# Altium project POWER.PrjPcb
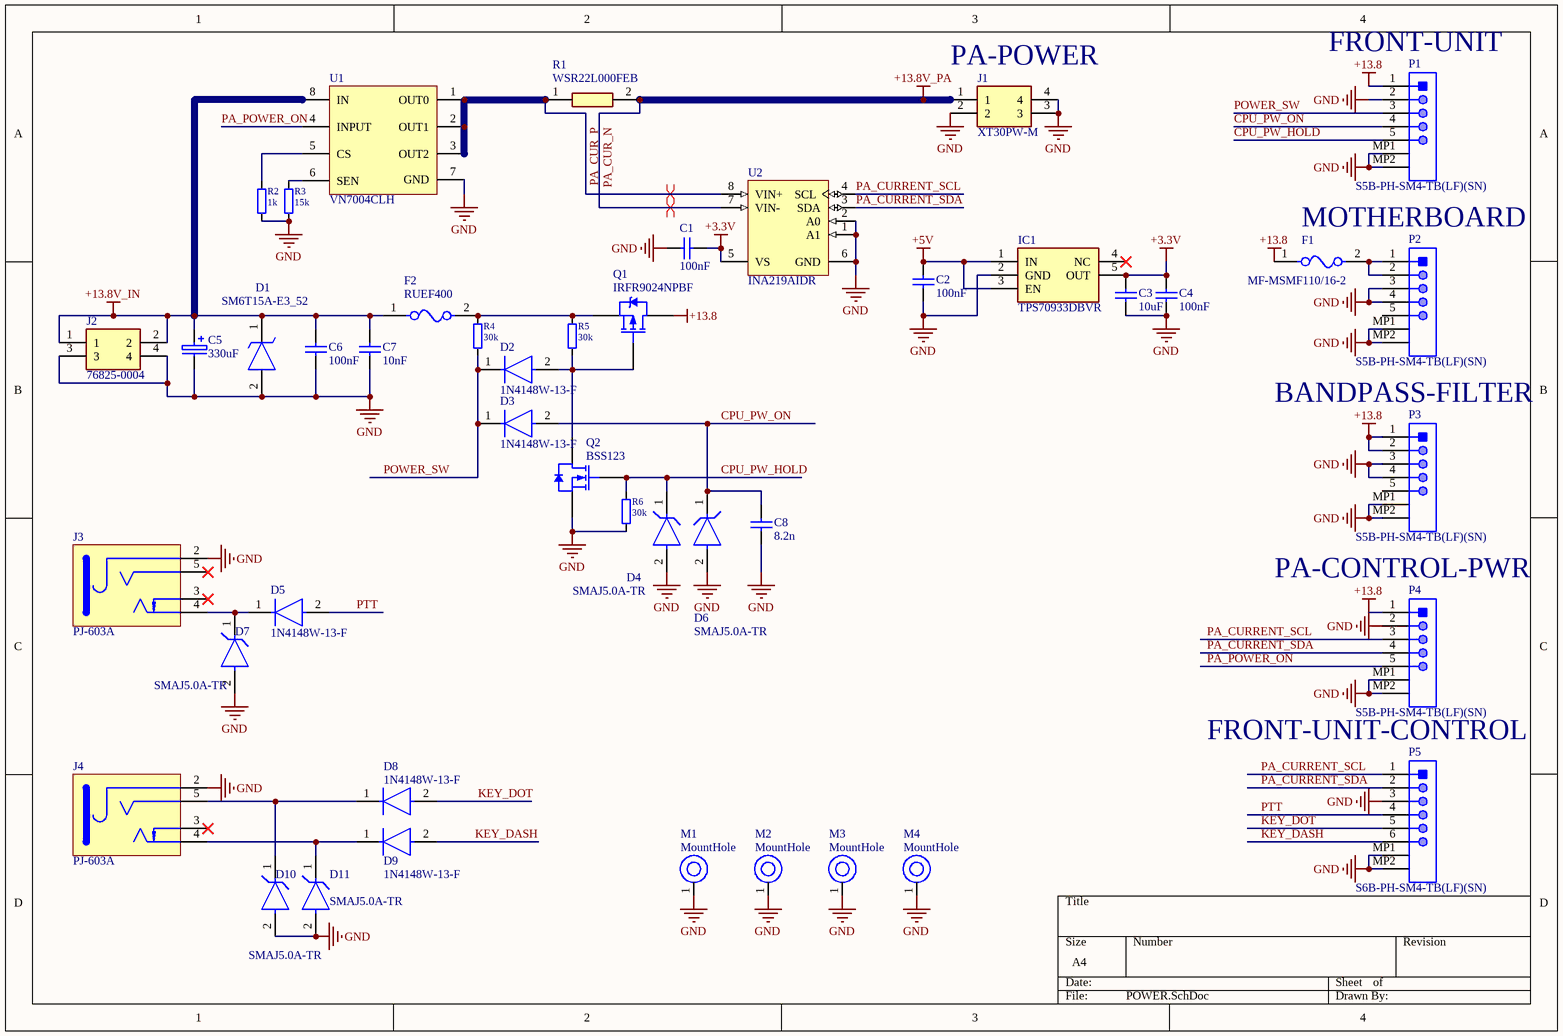
[diagram p0: POWER.SchDoc]
Revision: 4.0
2 sheets, 93 parts. Net scope: global (net labels, ports and power ports of the same name join across sheets).
Board files: POWER.PcbDoc, POWER_2layer.PcbDoc
Sheets:
  POWER.SchDoc
  USB.SchDoc

## Sheet POWER.SchDoc
size A4; SheetNumber: 1; SheetTotal: 2

### Parts
C1  100nF  [C-0805]
C2  100nF  [C-0805]
C3  10uF  [C-0805]
C4  100nF  [C-0805]
C5  330uF  [CE 5.0-10x12.5]
C6  100nF  [C-0805]
C7  10nF  [C-0805]
C8  8.2n  [C-0805]
D1  SM6T15A-E3_52  [DIOM5436X244N]
D2  1N4148W-13-F  [FP-SOD123-MFG]
D3  1N4148W-13-F  [FP-SOD123-MFG]
D4  SMAJ5.0A-TR  [FP-SMA-MFG]
D5  1N4148W-13-F  [FP-SOD123-MFG]
D6  SMAJ5.0A-TR  [FP-SMA-MFG]
D7  SMAJ5.0A-TR  [FP-SMA-MFG]
D8  1N4148W-13-F  [FP-SOD123-MFG]
D9  1N4148W-13-F  [FP-SOD123-MFG]
D10  SMAJ5.0A-TR  [FP-SMA-MFG]
D11  SMAJ5.0A-TR  [FP-SMA-MFG]
F1  MF-MSMF110/16-2  [FP-MF-MSMF110-16-MFG]
F2  RUEF400  [FP-RUEF400-MFG]
IC1  TPS70933DBVR  [SOT95P280X145-5N]
J1  XT30PW-M  [XT30PWM]
J2  76825-0004  [768250004]
J3  PJ-603A  [PJ-603A]
J4  PJ-603A  [PJ-603A]
M1  MountHole  [MountHole]
M2  MountHole  [MountHole]
M3  MountHole  [MountHole]
M4  MountHole  [MountHole]
P1  S5B-PH-SM4-TB(LF)(SN)  [JST-S5B-PH-SM4-TB_V]
P2  S5B-PH-SM4-TB(LF)(SN)  [JST-S5B-PH-SM4-TB_V]
P3  S5B-PH-SM4-TB(LF)(SN)  [JST-S5B-PH-SM4-TB_V]
P4  S5B-PH-SM4-TB(LF)(SN)  [JST-S5B-PH-SM4-TB_V]
P5  S6B-PH-SM4-TB(LF)(SN)  [JST-S6B-PH-SM4-TB(LF)(SN)_V]
Q1  IRFR9024NPBF  [ONSC-DPAK-3-369C-01_V]
Q2  BSS123  [FAIR-SOT23-3_V]
R1  WSR22L000FEB  [RESM11670X254N]
R2  1k  [R-0805]
R3  15k  [R-0805]
R4  30k  [R-0805]
R5  30k  [R-0805]
R6  30k  [R-0805]
U1  VN7004CLH  [OctaPAK7_6P1X6P5_STM-M]
U2  INA219AIDR  [D0008A_L]

### Nets
+3.3V: C1.1 C3.1 C4.1 IC1.5(OUT) U2.5(VS)
+5V: C2.1 IC1.1(IN) IC1.3(EN)
+13.8: F1.1 P1.1 P3.1 P3.2 P4.1 Q1.4(D)
+13.8V_IN: C5.1 C6.1 C7.1 D1.1(K) F2.1 J2.1 J2.2 U1.8(IN)
GND: C1.2 C2.2 C3.2 C4.2 C5.2 C6.2 C7.2 C8.2 D1.2(A) D4.2(A) D6.2(A) D7.2(A) D10.2(A) D11.2(A) IC1.2(GND) J1.2 J1.3 J1.4 J2.3 J2.4 J3.2 J4.2 M1.1 M2.1 M3.1 M4.1 P1.2 P1.MP1 P1.MP2 P2.3 P2.4 P2.MP1 P2.MP2 P3.3 P3.4 P3.MP1 P3.MP2 P4.2 P4.MP1 P4.MP2 P5.3 P5.MP1 P5.MP2 Q2.2(S) R2.1 R3.1 R6.1 U1.7(GND) U2.1(A1) U2.2(A0) U2.6(GND)
PA_CUR_N: J1.1 R1.2 U2.7(VIN-)  [also labelled +13.8V_PA]
CPU_PW_HOLD: D4.1(K) P1.5 Q2.1(G) R6.2
CPU_PW_ON: C8.1 D3.2(A) D6.1(K) P1.4
KEY_DASH: D9.2(A) P5.6
KEY_DOT: D8.2(A) P5.5
PA_CUR_P: R1.1 U1.1(OUT0) U1.2(OUT1) U1.3(OUT2) U2.8(VIN+)
PA_CURRENT_SCL: P4.3 P5.1 U2.4(SCL)
PA_CURRENT_SDA: P4.4 P5.2 U2.3(SDA)
PA_POWER_ON: P4.5 U1.4(INPUT)
POWER_SW: D2.1(C) D3.1(C) P1.3 R4.1
PTT: D5.2(A) P5.4
NetD2_2: D2.2(A) Q1.1(G) Q2.3(D) R5.1
NetD5_1: D5.1(C) D7.1(K) J3.4
NetD8_1: D8.1(C) D10.1(K) J4.5
NetD9_1: D9.1(C) D11.1(K) J4.4
NetF1_2: F1.2 P2.1 P2.2
NetF2_2: F2.2 Q1.3(S) R4.2 R5.2
NetR2_2: R2.2 U1.5(CS)
NetR3_2: R3.2 U1.6(SEN)

Not connected (* = marked no-connect by the designer): IC1 4(NC)*; J3 3* 5*; J4 3*; P2 5; P3 5

### Layout directives
differential pair: PA_CUR_N, PA_CUR_P

### Notes on the sheet
- (near J1) PA-POWER
- (near P1) FRONT-UNIT
- MOTHERBOARD
- BANDPASS-FILTER
- PA-CONTROL-PWR
- FRONT-UNIT-CONTROL

### Library data of the parts
C1-C4 C6-C8 = C semi: Ceramic Multilayer Capacitor; Manufacturer: Yageo/Phycomp; Manufacturer P/N: CC0603JRNPO9BN102; numsch: 011; TypeNum: 155; Parameters: 1nF, NP0, 50V, ±5%; Tolerance: ±10%; Voltage: *
C5 = CE: Capacitor Electrolytic; Manufacturer: Yageo/Phycomp; Manufacturer P/N: SK 016 M 470; numsch: 019; TypeNum: 185; Parameters: 470uF, SK, 16V, ±20%; Tolerance: ±20%; Voltage: *; Series: *
D1 = SM6T15A-E3_52: TVS Diode (Uni-directional); Manufacturer_Name: Vishay; Manufacturer_Part_Number: SM6T15A-E3/52; Datasheet Link: https://www.vishay.com/docs/88385/sm6t.pdf; Height: 2.44mm; Mouser Part Number: 625-SM6T15A-E3; Mouser Price/Stock: https://www.mouser.co.uk/ProductDetail/Vishay-General-Semiconductor/SM6T15A-E3-52?qs=nmw3K3MsCZZRtlXmnTWYow%3D%3D; Arrow Part Number: SM6T15A-E3/52; Arrow Price/Stock: https://www.arrow.com/en/products/sm6t15a-e352/vishay?region=nac
D2 D3 D5 D8 D9 = CMP-12791-000005-1: DIODE GEN PURP 100V 150MA SOD123; Manufacturer: Diodes Inc.; Capacitance: 2pF; Forward Current: 300mA; Max Junction Temp: +150°C; Value: 2pF; Standoff Height: 0mm; Peak Reverse Current: 1uA; Max Surge Forward Current: 1A; Category: Diode; Height: 1.45mm; ComponentLink2URL: https://upverter.com/datasheet/628e7d6fee5901eee6eef4567d1c3569f2cd3cde.pdf; Lead Free: Yes; ComponentLink2Description: Datasheet; Octopart: https://octopart.com/1n4148w-13-f-diodes+inc.-2359612; Temperature Range High: +150°C; Device Class L2: Diodes; Digikey Description: DIODE GEN PURP 100V 150MA SOD123; Reverse Voltage: 100V; Temperature Range Low: -65°C; Device Class L1: Discrete Semiconductors; Package: SOD123; RoHS: TRUE; Manufacturer Part Number: 1N4148W-13-F; Footprint Url: https://www.diodes.com/assets/Package-Files/SOD123.pdf; Automotive: No; Max Repetitive Reverse Voltage: 100V; Mouser Description: 1N4148W Series 2 A 100 V 400 mW Surface Mount Fast Switching Diode - SOD-123; Temperature: -65°C to +150°C; Device Class L3: Rectifier Diodes
D4 D6 D7 D10 D11 = CMP-12225-000048-1: TVS DIODE 5V 13.4V SMA; Manufacturer: STMicroelectronics; Standoff Height: 0.05mm; Max Junction Temp: +150°C; Clamping Voltage: 9.2V; Number Of Channels: 1; Peak Pulse Power: 400W; Peak Pulse Current: 43.5A; Breakdown Voltage: 6.4V; Direction: Unidirectional; ComponentLink2Description: Datasheet; Lead Free: Yes; Package: SMA; Height: 2.65mm; Mouser Description: Transient Voltage Suppressor, TVS, Transil SMAJ Series, Unidirectional, 5 V, DO-214AC, 2, 6.4 V; Manufacturer Part Number: SMAJ5.0A-TR; Reverse Standoff Voltage: 5V; Temperature Range Low: -55°C; Device Class L1: Circuit Protection; RoHS: TRUE; Category: Diode; Automotive: No; ComponentLink2URL: https://www.st.com/resource/en/datasheet/smaj.pdf; Device Class L3: unset; Device Class L2: TVS Diodes; Temperature Range High: +150°C; Octopart: https://octopart.com/smaj5.0a-tr-stmicroelectronics-347063; Digikey Description: TVS DIODE 5V 13.4V SMA; Temperature: -55°C to +150°C
F1 = CMP-07400-000018-1: PTC RESET FUSE 16V 1.1A 1812; Manufacturer: Bourns; Automotive Grade: Grade 3; Trip Current: 2.2A; Trip Time: 0.3s; Value: 0.04-0.21Ω; Current Rating: 100A; Category: Fuse; ComponentLink2Description: Datasheet; Temperature: -40°C to +85°C; Octopart: https://octopart.com/mf-msmf110%2F16-2-bourns-40767; Ambient Temperature Range Low: -40°C; Manufacturer Part Number: MF-MSMF110/16-2; Device Class L3: unset; RoHS: TRUE; Device Class L2: PTC Resettable Fuses; Package: MF-MSMF110/16; Digikey Description: PTC RESET FUSE 16V 1.1A 1812; Height: 0.85mm; Mouser Description: Resettable Fuses - PPTC 1.1A 16V 0.04ohm; Lead Free: Yes; Automotive: Yes; Hold Current: 1.1A; Resistance: 0.04-0.21Ω; Temperature Range Low: -40°C; Device Class L1: Circuit Protection; Ambient Temperature Range High: +85°C; Voltage Rating: 16V; ComponentLink2URL: https://upverter.com/datasheet/72639194a1e73201de7e7957ee4193eb5a54a50e.pdf; Temperature Range High: +85°C
F2 = CMP-08606-000051-1: PTC RESET FUSE 30V 4A RADIAL; Manufacturer: Littelfuse; Current Rating: 100A; Resistance: 0.01-0.05Ω; Trip Time: 12.7s; Trip Current: 8A; Value: 0.01-0.05Ω; Hold Current: 4A; Ambient Temperature Range Low: -40°C; Temperature Range Low: -40°C; Temperature Range High: +85°C; Lead Free: Yes; ComponentLink2URL: https://www.littelfuse.com/~/media/electronics/datasheets/resettable_ptcs/littelfuse_ptc_radial_leaded_ruef_datasheet.pdf.pdf; Temperature: -40°C to +85°C; Device Class L1: Circuit Protection; Voltage Rating: 30V; Ambient Temperature Range High: +85°C; Digikey Description: PTC RESET FUSE 30V 4A RADIAL; RoHS: TRUE; Automotive: No; Category: Fuse; Mouser Description: PTC Resettable Fuse 4A(hold) 8A(trip) 30V 100A 2.5W 12.7s 0.01Ohm Radial 14 X 3 X 19.3mm Bag; Device Class L2: PTC Resettable Fuses; Package: RUEF400; Height: 19.3mm; Device Class L3: unset; ComponentLink2Description: Datasheet; Octopart: https://octopart.com/ruef400-littelfuse-74215791; Manufacturer Part Number: RUEF400
IC1 = TPS70933DBVR: Integrated Circuit; Manufacturer_Name: Texas Instruments; Datasheet Link: http://www.ti.com/lit/gpn/tps709; Height: 1.45mm; Manufacturer_Part_Number: TPS70933DBVR; Mouser Part Number: 595-TPS70933DBVR; Mouser Price/Stock: https://www.mouser.co.uk/ProductDetail/Texas-Instruments/TPS70933DBVR?qs=Z9twEOuL%252B%2FJOaGO60BtvLA%3D%3D; Arrow Part Number: TPS70933DBVR; Arrow Price/Stock: https://www.arrow.com/en/products/tps70933dbvr/texas-instruments?region=nac
J1 = XT30PW-M: Connector; Manufacturer_Name: Amass; Datasheet Link: https://www.tme.eu/sl/Document/ce4077e36b79046da520ca73227e15de/XT30PW%20SPEC.pdf; Height: 5mm; Manufacturer_Part_Number: XT30PW-M
J2 = 76825-0004: Connector; Manufacturer_Name: Molex; Datasheet Link: https://componentsearchengine.com//76825-0004.pdf; Height: 16mm; Mouser2 Part Number: 538-76825-0004; Mouser2 Price/Stock: https://www.mouser.com/Search/Refine.aspx?Keyword=538-76825-0004; Manufacturer_Part_Number: 76825-0004
P1-P4 = CMP-2000-07026-1: Male Header, Pitch 2 mm, 1 x 5 Position, Height 5.5 mm, -25 to 85 degC, RoHS, Tape and Reel; Manufacturer: JST; No of Positions: 5; Pitch: 2mm; Style/Orientation: RightAngleHeader/Plug; Manufacturer URL: http://www.jst.com/home2.html; Datasheet URL: http://www.jst-mfg.com/product/pdf/eng/ePH.pdf; Termination: Crimp; Mounting Technology: SurfaceMount; Package Reference: S5B-PH-SM4-TB; Type: WiretoBoard; Datasheet Version: 12/2012; Package Description: Male Header, Pitch 2 mm, 1 x 5 Position, Height 5.5 mm
P5 = CMP-2000-07027-1: Male Header, Pitch 2 mm, 1 x 6 Position, Height 5.5 mm, -25 to 85 degC; Manufacturer: JST; Pitch: 2mm; Style/Orientation: RightAngleHeader/Plug; No of Positions: 6; Package Reference: S6B-PH-SM4-TB(LF)(SN); Type: ShroudedHeader; Package Description: Male Header, Pitch 2 mm, 1 x 6 Position, Height 5.5 mm; Mounting Technology: SurfaceMount; Datasheet Version: 11/2008; Termination: Solder; Datasheet URL: https://datasheet.ciiva.com/11747/0900766b80df0d9d-11747278.pdf; Manufacturer URL: http://www.jst.com/home2.html
Q1 = CMP-1058-00387-1: IRFR9024NPBF, Транзистор, Р-канал 55В 11А; Manufacturer: On Semiconductor; PartNumber: NTD2955G; Ciss Typ (pF): 500; Qrr Typ (nC): 100; VGS Max (V): 20; PD Max (W): 55; Channel Polarity: P Channel; V(BR)DSS Min (V): 60; ID Max (A): 12; Configuration: Single; Crss Typ (pF): 50; Packing: Tape and Reel; VGS(th) Max (V): 4; Coss Typ (pF): 150; RoHS: Pb-Free; ComponentLink1Description: Manufacturer URL; Mounting Technology: Surface Mount; ComponentLink2URL: http://www.onsemi.cn/pub_link/Collateral/NTD2955-D.PDF; PackageDescription: 3-Pin Flange Mount, Body 6.54 x 6.095 mm, Pitch 2.29 mm; ComponentLink3Description: Package Specification; Package Type: DPAK-3, IPAK-4; ComponentLink3URL: http://www.onsemi.cn/pub_link/Collateral/369C.PDF; DatasheetVersion: Rev. 13; ComponentLink2Description: Datasheet; ComponentLink1URL: http://www.onsemi.com/; PackageVersion: Rev. E, 02/2014; PackageReference: DPAK-3-369C-01
Q2 = CMP-2000-04934-1: N-Channel Logic Level Enhancement Mode Field Effect Transistor, 1.7 V, -55 to 150 degC, 3-Pin SOT-23, RoHS, Tape and Reel; Manufacturer: Fairchild; Channel Type: N; Typical Turn-Off Delay Time: 17ns; Maximum Continuous Drain Current: 0.17A; Rad Hard: No; Typical Rise Time: 9ns; Typical Fall Time: 2.4ns; Maximum Gate Source Voltage: ±20V; Maximum Drain Source Voltage: 100V; Typical Turn-On Delay Time: 1.7ns; RDS-on: 6000@10VmOhm; Package Version: Rev. 12, 03/2016; Packaging: Tape&Reel; Package Reference: SOT23-3; Channel Mode: Enhancement; Operating Temperature: -55to150degC; Package Description: 3-Pin Small Outline Transistor, Body 2.92 x 1.325 mm, Pitch 0.95 mm; Category: MOSFET; Datasheet Version: Jun-03; Datasheet URL: https://www.fairchildsemi.com/datasheets/BS/BSS123.pdf; Manufacturer URL: https://www.fairchildsemi.com/; Mounting: SurfaceMount; Package: 3SOT-23; Package URL: http://www.fairchildsemi.com/dwg/MA/MA03D.pdf
R1 = WSR21L000FEA: Resistor; Manufacturer_Name: Vishay; Datasheet Link: https://componentsearchengine.com/Datasheets/1/WSR21L000FEA.pdf; Height: 2.537mm; Manufacturer_Part_Number: WSR21L000FEA; Mouser Part Number: 71-WSR21L000FEA; Mouser Price/Stock: https://www.mouser.com/Search/Refine.aspx?Keyword=71-WSR21L000FEA; Arrow Part Number: WSR21L000FEA; Arrow Price/Stock: https://www.arrow.com/en/products/wsr21l000fea/vishay
R2-R6 = RES semi: Chip Resistor; Manufacturer: Yageo/Phycomp; Manufacturer P/N: RC0603FR-0749R9L; numsch: 021; TypeNum: 212; Parameters: 49.9R, RC, 0.1W, ±1%, TCR ±100ppm; Power: *; TCR: *; Series: *; Tolerance: *
U2 = CMP-0704-00003-2: Zero-Drift, Bi-Directional Current / Power Monitor, 3 to 5.5 V, -40 to 125 degC, 8-pin SOIC (D8), Green (RoHS & no Sb/Br); Manufacturer: Texas Instruments; Common Mode Range(Min)(V): 0; SubFamily: Current Shunt Monitor; Rating: Catalog; Input Offset (+/-)(Max)(uV): 100; Vs(Max)(V): 5.5; Common Mode Range(Max)(V): 26; Quiescent Current (+/-)(Typ)(mA): 0.7; Vs(Min)(V): 3; Gain(V/V): 1, 0.5, 0.25, 0.125; Small-Signal Bandwidth(Typ)(MHz): 0.011; PackageReference: D0008A; ComponentLink1URL: http://www.ti.com/; Eco-Plan: Green (RoHS & no Sb/Br); ComponentLink2URL: http://www.ti.com/general/docs/lit/getliterature.tsp?genericPartNumber=INA219&fileType=pdf; ComponentLink1Description: Manufacturer URL; ComponentLink3Description: Package Specification; Mounting Technology: Surface Mount; PackageDescription: 8-Pin Plastic Small Outline, Body 4.9 x 3.9 mm, Pitch 1.27 mm; ComponentLink3URL: http://www.ti.com/lit/ml/msoi002j/msoi002j.pdf; DatasheetVersion: SBOS448F; PackageVersion: 4040047-3/M, 06/2011; PartNumber: INA219AIDR; Code_JEDEC: MS-012; ComponentLink2Description: Datasheet; CMRR(Min)(dB): 100

## Sheet USB.SchDoc
size A4; SheetNumber: 2; SheetTotal: 2
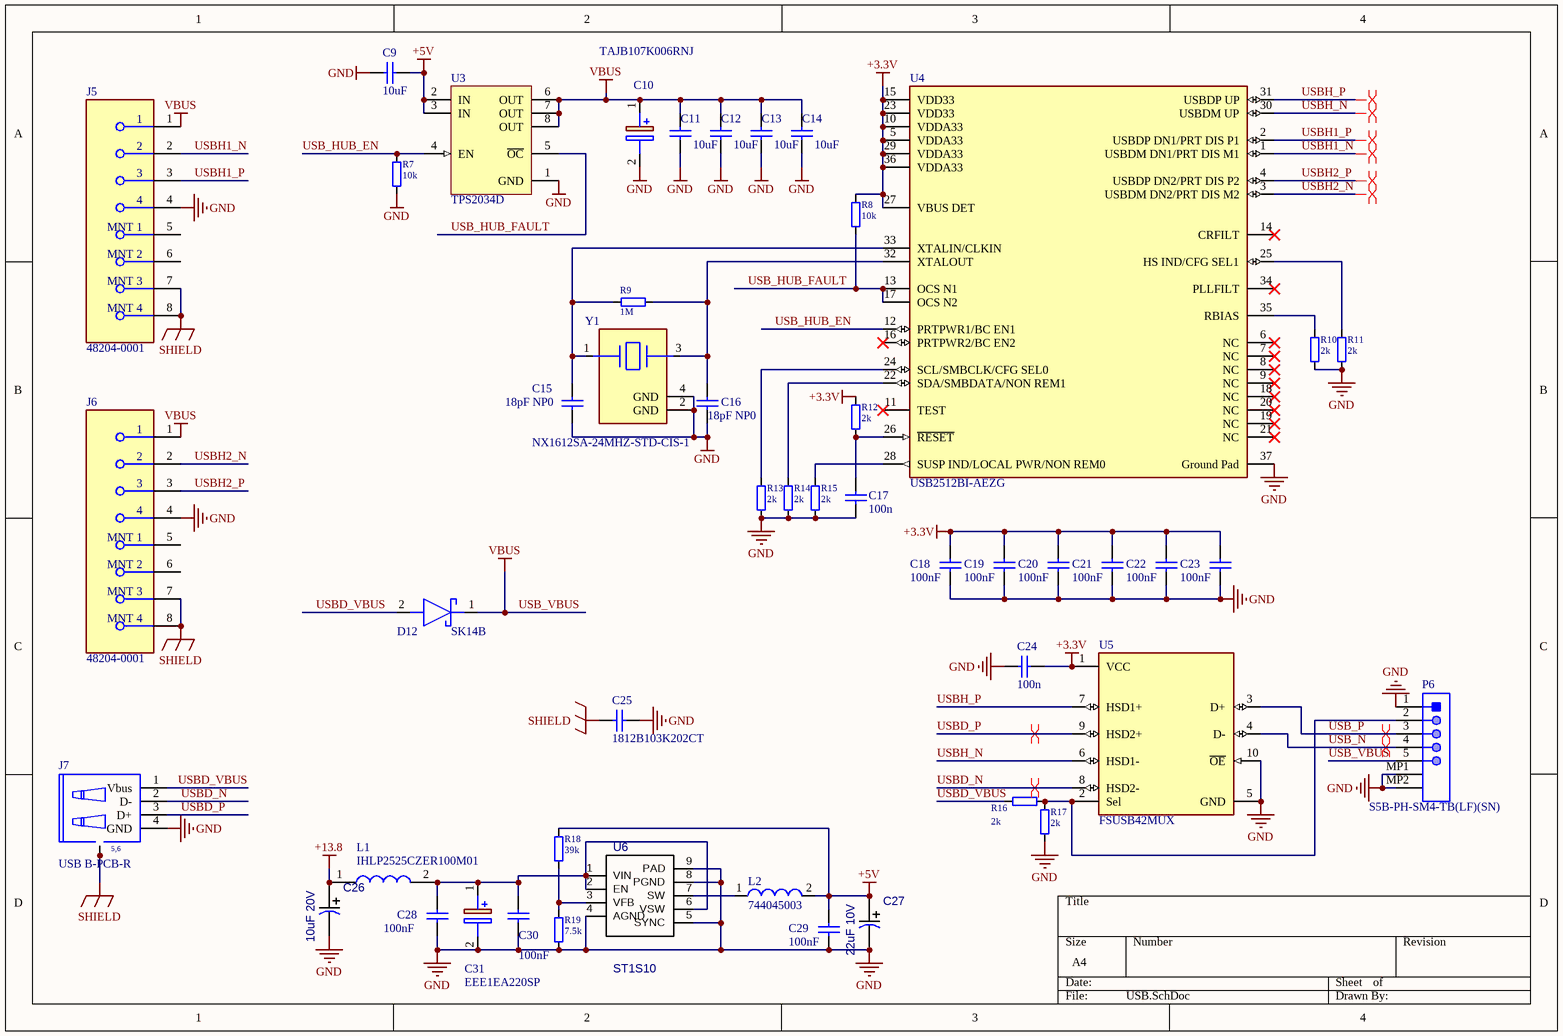
[diagram p1: USB.SchDoc]

### Parts
C9  10uF  [C-0805]
C10  TAJB107K006RNJ  [CAPPM3528X210N]
C11  10uF  [C-0805]
C12  10uF  [C-0805]
C13  10uF  [C-0805]
C14  10uF  [C-0805]
C15  18pF NP0  [C-0805]
C16  18pF NP0  [C-0805]
C17  100n  [C-0805]
C18  100nF  [C-0805]
C19  100nF  [C-0805]
C20  100nF  [C-0805]
C21  100nF  [C-0805]
C22  100nF  [C-0805]
C23  100nF  [C-0805]
C24  100n  [C-0805]
C25  1812B103K202CT  [CAPC4632X280X75LL50T35]
C26  10uF 20V  [CAPAE_4.3x4.3h5.4]
C27  22uF 10V  [CAPAE_4.3x4.3h5.4]
C28  100nF  [C-0805]
C29  100nF  [C-0805]
C30  100nF  [C-0805]
C31  EEE1EA220SP  [EEE1AA101SP]
D12  SK14B  [DIOM5236X261N]
J5  48204-0001  [FP-48204-0001-MFG]
J6  48204-0001  [FP-48204-0001-MFG]
J7  USB B-PCB-R  [USB_B_PCB_R]
L1  IHLP2525CZER100M01  [INDPM6965X300N]
L2  744045003  [WE-LQ-L]
P6  S5B-PH-SM4-TB(LF)(SN)  [JST-S5B-PH-SM4-TB_V]
R7  10k  [R-0805]
R8  10k  [R-0805]
R9  1M  [R-0805]
R10  2k  [R-0805]
R11  2k  [R-0805]
R12  2k  [R-0805]
R13  2k  [R-0805]
R14  2k  [R-0805]
R15  2k  [R-0805]
R16  2k  [R-0805]
R17  2k  [R-0805]
R18  39k  [R-0805]
R19  7.5k  [R-0805]
U3  TPS2034D  [D0008A_N]
U4  USB2512BI-AEZG  [FP-USB2512BI-AEZG-MFG]
U5  FSUSB42MUX  [FP-846AP-MFG]
U6  ST1S10  [ST1S10]
Y1  NX1612SA-24MHZ-STD-CIS-1  [FP-NX3225GA-MFG]

### Nets
+3.3V: C18.1 C19.1 C20.1 C21.1 C22.1 C23.1 C24.2 R8.1 R12.2 U4.5(VDDA33) U4.10(VDDA33) U4.15(VDD33) U4.23(VDD33) U4.27(VBUS_DET) U4.29(VDDA33) U4.36(VDDA33) U5.1(VCC)
+5V: C9.1 C27.1(PLUS) C29.1 L2.2 R18.1 U3.2(IN) U3.3(IN)
+13.8: C26.1(PLUS) L1.1
GND: C9.2 C10.2(-) C11.2 C12.2 C13.2 C14.2 C15.1 C16.1 C17.1 C18.2 C19.2 C20.2 C21.2 C22.2 C23.2 C24.1 C25.2 C26.2(MINUS) C27.2(MINUS) C28.2 C29.2 C30.2 C31.2(-) J5.4 J6.4 J7.4(GND) P6.1 P6.MP1 P6.MP2 R7.1 R10.1 R11.1 R13.1 R14.1 R15.1 R17.1 R19.2 U3.1(GND) U4.37(Ground_Pad) U5.5(GND) U5.10(~{OE}) U6.4(AGND) U6.5(SYNC) U6.8(PGND) U6.9(PAD) Y1.2(GND) Y1.4(GND)
SHIELD: C25.1 J5.7(MNT_3) J5.8(MNT_4) J6.7(MNT_3) J6.8(MNT_4) J7.5 J7.6
USB_VBUS: C10.1(+) C11.1 C12.1 C13.1 C14.1 D12.1(K) J5.1 J6.1 P6.5 U3.6(OUT) U3.7(OUT) U3.8(OUT)  [also labelled VBUS]
USB_HUB_EN: R7.2 U3.4(EN) U4.12(PRTPWR1/BC_EN1)
USB_HUB_FAULT: R8.2 U3.5(~{OC}) U4.13(OCS_N1) U4.17(OCS_N2)
USB_N: P6.4 U5.4(D-)
USB_P: P6.3 U5.3(D+)
USBD_N: J7.2(D-) U5.8(HSD2-)
USBD_P: J7.3(D+) U5.9(HSD2+)
USBD_VBUS: D12.2(A) J7.1(Vbus) R16.2
USBH1_N: J5.2 U4.1(USBDM_DN1/PRT_DIS_M1)
USBH1_P: J5.3 U4.2(USBDP_DN1/PRT_DIS_P1)
USBH2_N: J6.2 U4.3(USBDM_DN2/PRT_DIS_M2)
USBH2_P: J6.3 U4.4(USBDP_DN2/PRT_DIS_P2)
USBH_N: U4.30(USBDM_UP) U5.6(HSD1-)
USBH_P: U4.31(USBDP_UP) U5.7(HSD1+)
NetC15_2: C15.2 R9.2 U4.33(XTALIN/CLKIN) Y1.1
NetC16_2: C16.2 R9.1 U4.32(XTALOUT) Y1.3
NetC17_2: C17.2 R12.1 U4.26(~{RESET})
NetC28_1: C28.1 C30.1 C31.1(+) L1.2 U6.1(VIN) U6.2(EN) U6.6(VSW)
NetL2_1: L2.1 U6.7(SW)
NetP6_2: P6.2 R16.1 R17.2 U5.2(Sel)
NetR10_2: R10.2 U4.35(RBIAS)
NetR11_2: R11.2 U4.25(HS_IND/CFG_SEL1)
NetR13_2: R13.2 U4.24(SCL/SMBCLK/CFG_SEL0)
NetR14_2: R14.2 U4.22(SDA/SMBDATA/NON_REM1)
NetR15_2: R15.2 U4.28(SUSP_IND/LOCAL_PWR/NON_REM0)
NetR18_2: R18.2 R19.1 U6.3(VFB)

Not connected (* = marked no-connect by the designer): J5 5(MNT_1) 6(MNT_2); J6 5(MNT_1) 6(MNT_2); U4 6(NC)* 7(NC)* 8(NC)* 9(NC)* 11(TEST)* 14(CRFILT)* 16(PRTPWR2/BC_EN2)* 18(NC)* 19(NC)* 20(NC)* 21(NC)* 34(PLLFILT)*

### Layout directives
differential pair: USB_N, USB_P, USBD_N, USBD_P, USBH1_N, USBH1_P, USBH2_N, USBH2_P, USBH_N, USBH_P

### Notes on the sheet
- (in symbol Conn USB 4P) 5,6

### Library data of the parts
C9 C11-C24 C28-C30 = C semi: as C1 on sheet POWER; Voltage: *
C10 = TAJB107K006RNJ: Capacitor Polarised; Manufacturer_Name: AVX; Datasheet Link: http://datasheets.avx.com/TAJ.pdf; Height: 2.1mm; Manufacturer_Part_Number: TAJB107K006RNJ; Mouser Part Number: 581-TAJB107K006R; Mouser Price/Stock: https://www.mouser.co.uk/ProductDetail/AVX/TAJB107K006RNJ?qs=fdqkYiOtZpcsxthKdBMg8Q%3D%3D; Arrow Part Number: TAJB107K006RNJ; Arrow Price/Stock: https://www.arrow.com/en/products/tajb107k006rnj/avx?region=nac
C25 = CMP-2000-05506-1: X7R ±10% 2kV 10nF 1812 Multilayer Ceramic Capacitors MLCC - SMD/SMT ROHS; Manufacturer: AVX; Rated Voltage: 1000V; Mounting Technology: SurfaceMount; Datasheet Version: 01/2016; Package Description: 2-Pin Surface Mount Device, Body 4.6 x 3.2 mm; Capacitance: 10nF; Dielectric: X7R; Manufacturer URL: http://www.avx.com/; Case Size/Dimension: 1812; Datasheet URL: http://datasheets.avx.com/HV-FlexitermMLCC.pdf; Package Reference: 1812; Tolerance (%): ±10%
C26 C27 = CAPAE_4.3x4.3h5.4
  C26: Value: 10uF 20V
  C27: Value: 22uF 10V
C31 = EEE1EA220SP: Capacitor Polarised; Manufacturer_Name: Panasonic; Datasheet Link: http://industrial.panasonic.com/cdbs/www-data/pdf/RDE0000/ABA0000C1145.pdf; Height: 7.8mm; Manufacturer_Part_Number: EEE1EA220SP
D12 = SK14B: Schottky Diode; Manufacturer_Name: Taiwan Semiconductor; Datasheet Link: https://datasheet.datasheetarchive.com/originals/distributors/Datasheets-35/DSA-697770.pdf; Height: 2.61mm; Manufacturer_Part_Number: SK14B; Mouser Part Number: 821-SK14B; Mouser Price/Stock: https://www.mouser.co.uk/ProductDetail/Taiwan-Semiconductor/SK14B?qs=tHU%2FlV7kTyTJWY0R1AZI9A%3D%3D
J5 J6 = CMP-0411-00001-3: CONN RCPT USB2.0 TYPEA 4POS R/A; Max Voltage Rating (DC): 3.03kV; Number of Contacts: 4; Current Rating: 1.5A; Voltage Rating: 30V; Connector Type: USB; Insulation Resistance: 1GR; Number of Ports: 1; Gender: Female; Pitch: 2mm; Min Operating Temperature: -55°C; Series: 48204; Number of Rows: 3; Length: 7.2mm; Package Quantity: 60; Contact Plating: Bronze; Termination: Solder; Voltage Rating (AC): 30V; Max Voltage Rating (AC): 30V; Depth: 19.25mm; Number of Circuits: 4; Flammability Rating: UL94 V-0; Contact Material: Tin; Housing Material: Polyester; Packaging: Tray; Color: Black; Orientation: Right Angle; Radiation Hardening: No; Number of Terminals/Pins: 4; Features: Shielded; Max Operating Temperature: 85°C; Weight: 0.09524oz
J7 = Conn USB 4P: Connector USB B-PCB-90 deg; Manufacturer: SST; Manufacturer P/N: USB-001-B; TypeNum: 820; Manufacturer No: *; Manufacturer No2: *; Manufacturer Link: *; Parameters: *
L1 = IHLP2525CZER100M01: Inductor; Manufacturer_Name: Vishay; Datasheet Link: https://www.vishay.com/docs/34104/ihlp-2525cz-01.pdf; Height: 3mm; Manufacturer_Part_Number: IHLP2525CZER100M01; Mouser Part Number: 70-IHLP2525CZER100M0; Mouser Price/Stock: https://www.mouser.co.uk/ProductDetail/Vishay-Dale/IHLP2525CZER100M01?qs=PA%252BPfIdQ8xl3JLrMc5InbA%3D%3D; Arrow Part Number: IHLP2525CZER100M01; Arrow Price/Stock: https://www.arrow.com/en/products/ihlp2525czer100m01/vishay?region=nac
L2 = CMP-0227-00587-1: SMD-RF-Inductor WE-LQ, L = 3.30 µH; Inductance: 3.30 ÂµH; ComponentLink2URL: http://www.we-online.de/katalog/media/pdf/744045003.pdf; ComponentLink2Description: Datasheet; PackageDescription: Inductor, 2-Leads, Body 4.5 x 3.2 mm; PackageReference: WE-LQ-L; DatasheetVersion: ver 3, Jul-2006; ComponentLink1URL: http://www.we-online.com; ComponentLink1Description: Manufacturer Link; PackageVersion: 2006
P6 = CMP-2000-07026-1: as P1 on sheet POWER; Manufacturer URL: http://www.jst.com/home2.html; Datasheet URL: http://www.jst-mfg.com/product/pdf/eng/ePH.pdf; Termination: Crimp; Mounting Technology: SurfaceMount; Package Reference: S5B-PH-SM4-TB; Type: WiretoBoard; Datasheet Version: 12/2012; Package Description: Male Header, Pitch 2 mm, 1 x 5 Position, Height 5.5 mm
R7-R19 = RES semi: as R2 on sheet POWER; Power: *; TCR: *; Series: *; Tolerance: *
U3 = CMP-0337-00092-2: 2.2 A, 2.7 to 5.5 V Single Hot-Swap IC Hi-Side MOSFET, Fault Report, Act-High Enable, 33 mOhms, -40 to 85 degC, 8-pin SOIC (D), Green (RoHS & no Sb/Br); Manufacturer: Texas Instruments; Enable: Active High; Number of Switches: 1; Vin(Max)(V): 5.5; Rating: Catalog; Vin(Min)(V): 2.7; rDS(on) per FET(Typ)(mOhms): 33; Current Limit(A): 3; Continuous Current(Max)(A): 2; PackageDescription: 8-Pin Plastic Small Outline Integrated Circuit, 4.9 x 3.9 mm, Pitch 1.27 mm Pitch; PackageReference: D0008A; Code_JEDEC: MS-012AA; DatasheetVersion: SLVS190C; ComponentLink1URL: http://www.ti.com/general/docs/lit/getliterature.tsp?genericPartNumber=TPS2034&fileType=pdf; Mounting Technology: Surface Mount; ComponentLink1Description: Datasheet; PartNumber: TPS2034D; PackageVersion: revM, Jun-2011; Eco-Plan: Green (RoHS & no Sb/Br)
U4 = CMP-06284-000006-1: IC USB 2.0 2PORT HUB CTLR 36QFN; Manufacturer: Microchip Technology; Interface: I2C,USB,SMBus; Max Supply Voltage: 3.6V; Standoff Height: 0mm; Number Of Ports: 2; Usb Standard: USB 2.0; Min Supply Voltage: 3V; Automotive: No; Temperature: -40°C to +85°C; Ambient Temperature Range Low: -40°C; Lead Free: Yes; RoHS: TRUE; Height: 1mm; Category: IC; ComponentLink2Description: Datasheet; Device Class L1: Integrated Circuits (ICs); Octopart: https://octopart.com/usb2512bi-aezg-microchip-24995415; Device Class L3: USB Interface ICs; Manufacturer Part Number: USB2512BI-AEZG; ComponentLink2URL: http://ww1.microchip.com/downloads/en/DeviceDoc/00001692C.pdf; Ipc Land Pattern Name: QFN50P600X600X90-36; Temperature Range Low: -40°C; Mouser Description: USB Interface IC USB2.0 HIGH SPEED IND HUB CONTROLLER; Ambient Temperature Range High: +85°C; Digikey Description: IC USB 2.0 2PORT HUB CTLR 36QFN; Temperature Range High: +85°C; Package: 0; Device Class L2: Interface ICs
U5 = CMP-07103-000004-1: IC USB SWITCH DPDT 10MSOP; Voltage: 4.3V; Current: 100mA; Number of Inputs: 2; Supply Type: Single; Number of Outputs: 4; Data Rate: 480Mbps; On-State Resistance: 6.5R; Min Supply Voltage: 3V; Package Quantity: 1; Length: 3mm; Radiation Hardening: No; Number of Pins: 10; Width: 3mm; Number of Channels: 2; REACH SVHC: No SVHC; Lead Free: Lead Free; Max Operating Temperature: 85°C; Min Operating Temperature: -40°C; Packaging: Tape and Reel; Throw Configuration: DPDT; Operating Supply Voltage: 4.3V; Max Supply Voltage: 4.3V; Mount: Surface Mount; Case/Package: MSOP; Weight: 0.1125g; Height: 0.85mm
Y1 = CMP-200220-000007-1: CRYSTAL 16.0000MHZ 8PF SMD; Frequency Stability: 30ppm; Frequency Tolerance: 20ppm; Frequency: 16MHz; ESR (Equivalent Series Resistance): 80R; Min Operating Temperature: -40°C; Mount: Surface Mount; Width: 0.098inch; Case/Package: SMD/SMT; Max Operating Temperature: 85°C; Number of Pins: 4; Length: 0.126inch; Load Capacitance: 8pF; Packaging: Tape and Reel; Package Quantity: 3000; Height: 0.035inch

## Nets that join several sheets
+3.3V: POWER (5 pins), USB (17 pins)
+5V: POWER (C2.1 IC1.1 IC1.3), USB (7 pins)
+13.8: POWER (6 pins), USB (C26.1 L1.1)
GND: POWER (51 pins), USB (47 pins)